# Altium schematic sheet [4]-Wifi.SchDoc
size A3
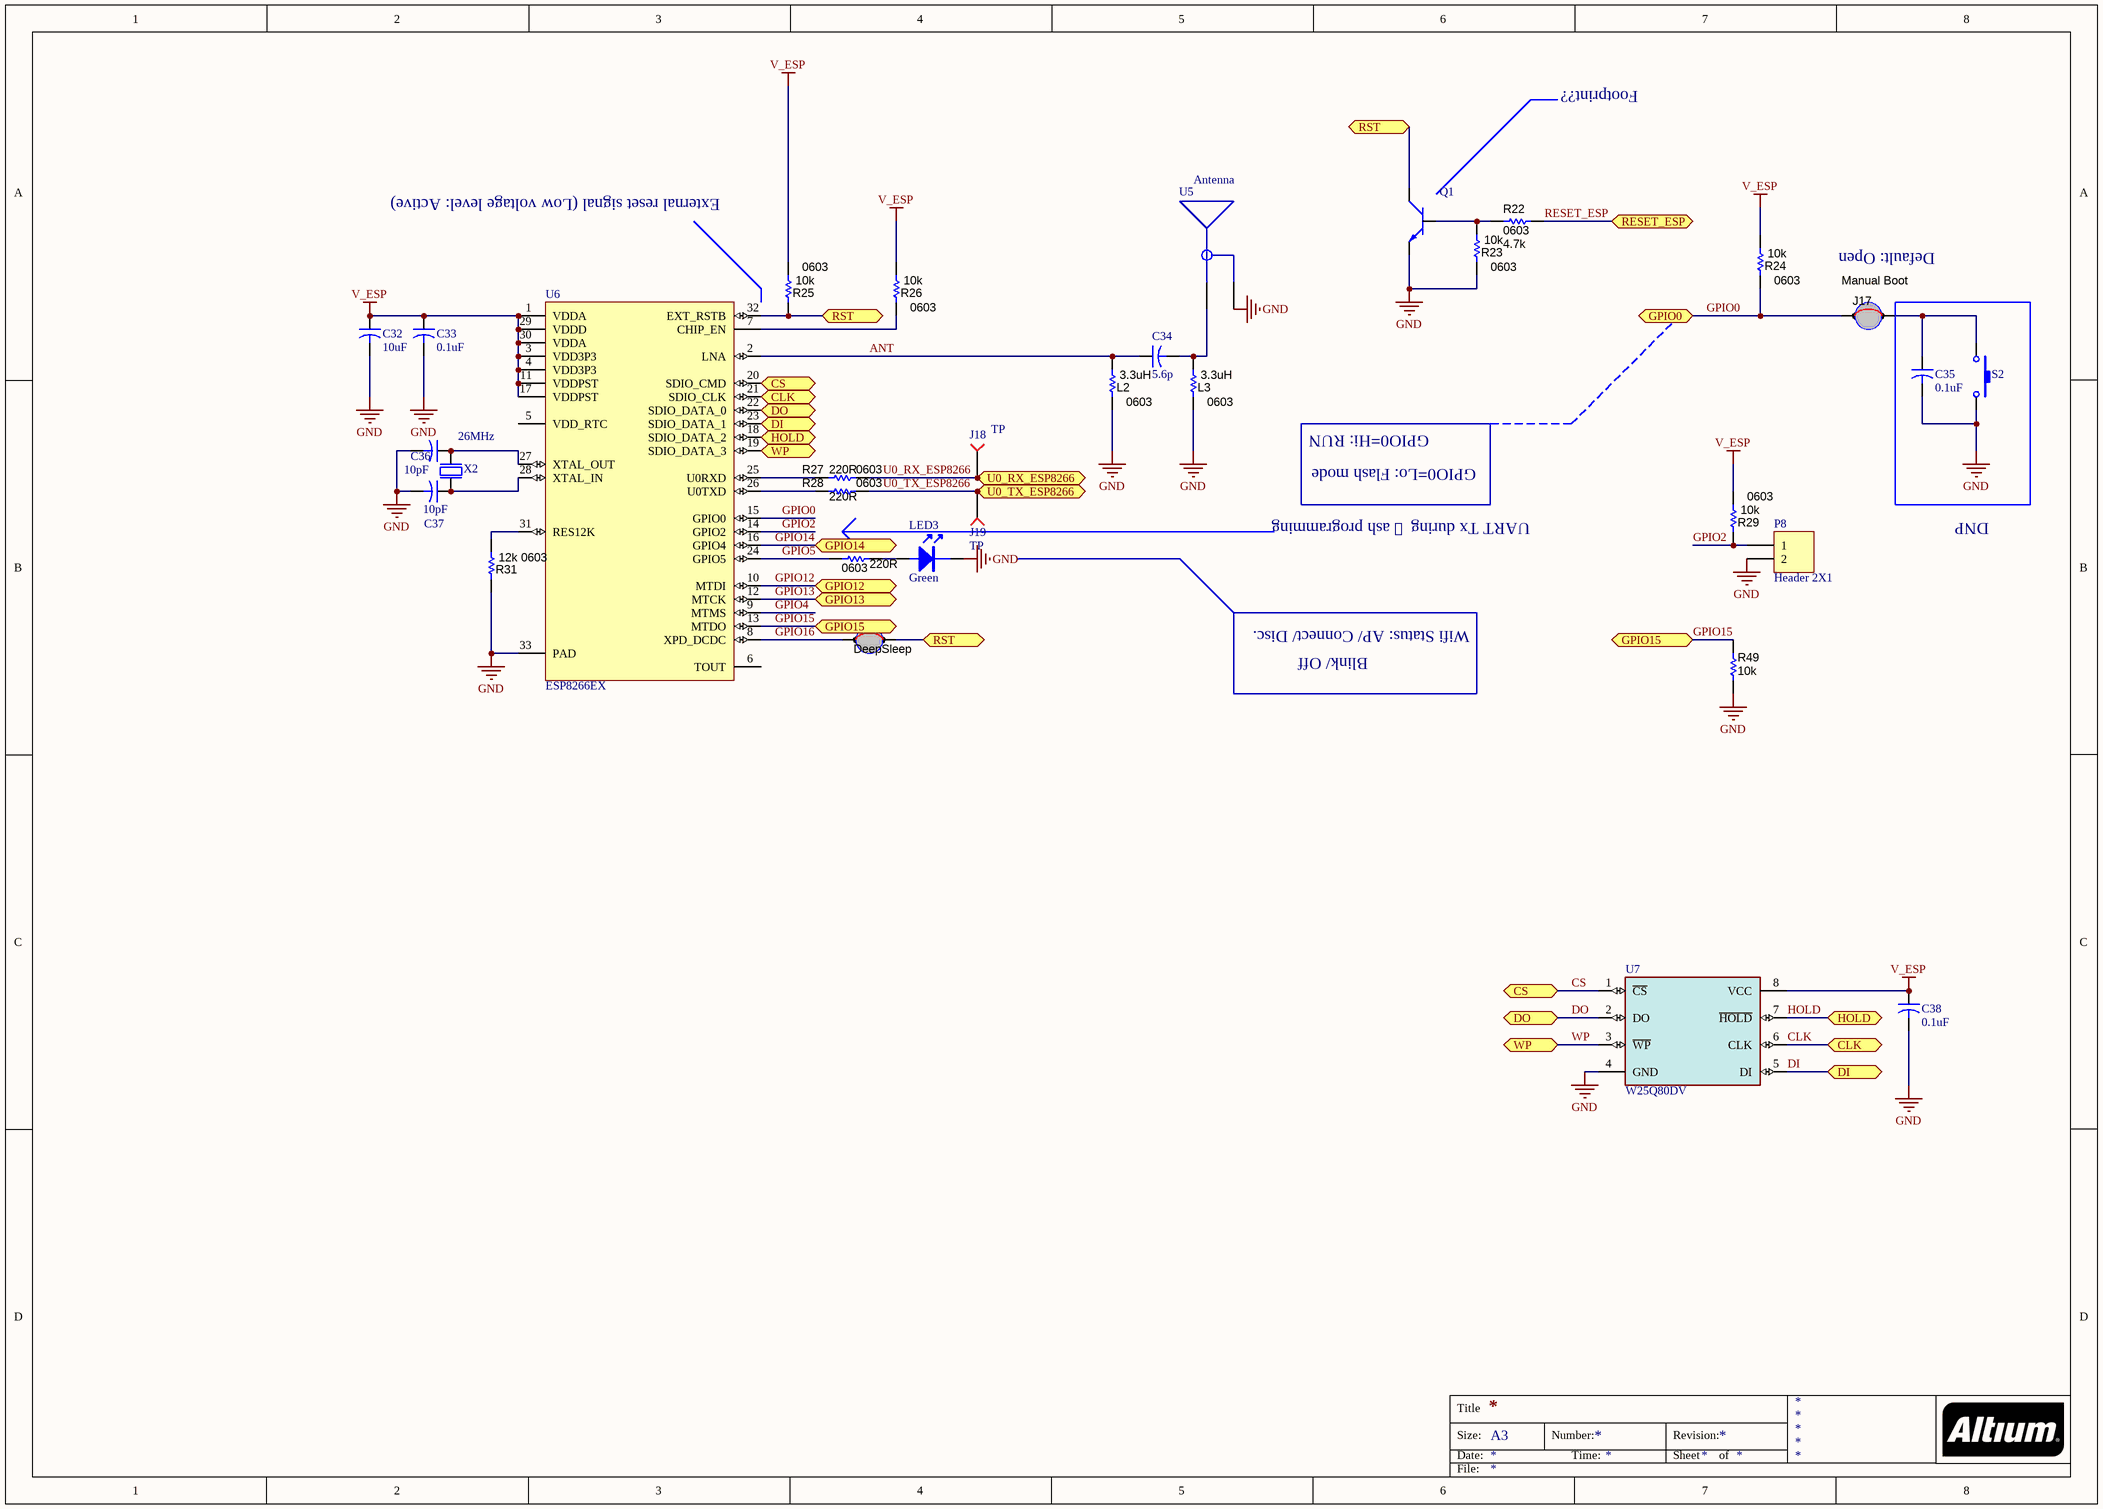
[diagram p0: [4]-Wifi.SchDoc]

## Parts
C32  10uF  [0603]
C33  0.1uF  [0603]
C34  5.6p  [0402]
C35  0.1uF  [0603]
C36  10pF  [0402]
C37  10pF  [0402]
C38  0.1uF  [0603]
J17  Manual Boot  [HDR1X2]
J18  TP  [TP]
J19  TP  [TP]
J20  DeepSleep  [HDR1X2]
L2  value 3.3uH  Value1: 0603  [0402]  (hidden comment: CRCW08051K00JNEA)
L3  value 3.3uH  Value1: 0603  [0402]  (hidden comment: CRCW08051K00JNEA)
LED3  Green  [led0603]
P8  Header 2X1  [hdr1X2]
Q1  MMBT2222A  [SOT23A]  (value not drawn)
R22  value 4.7k  [0603]  (hidden comment: CRCW08051K00JNEA)
R23  value 10k  [0603]  (hidden comment: CRCW08051K00JNEA)
R24  value 10k  [0603]  (hidden comment: CRCW08051K00JNEA)
R25  value 10k  [0603]  (hidden comment: CRCW08051K00JNEA)
R26  value 10k  [0603]  (hidden comment: CRCW08051K00JNEA)
R27  value 220R  [0603]  (hidden comment: CRCW08051K00JNEA)
R28  value 220R  [0603]  (hidden comment: CRCW08051K00JNEA)
R29  value 10k  [0603]  (hidden comment: CRCW08051K00JNEA)
R30  value 220R  [0603]  (hidden comment: CRCW08051K00JNEA)
R31  value 12k 0603  [0603]  (hidden comment: CRCW08051K00JNEA)
R49  value 10k  [0603]  (hidden comment: CRCW06031K00FKEA)
S2  SW-SMD  [SW-SMD]  (value not drawn)
U5  Antenna  [ANT_F]
U6  ESP8266EX  [QFN32_ESP8266]
U7  W25Q80DV  [SOIC8_208mil]
X2  26MHz  [BT-XTAL_3225]

## Ports
CLK (bidir), CS (bidir), DI (bidir), DO (bidir), GPIO0 (bidir), GPIO12 (bidir), GPIO13 (bidir), GPIO14 (bidir), GPIO15 (bidir), HOLD (bidir), RESET_ESP (bidir), RST (bidir), U0_RX_ESP8266 (bidir), U0_TX_ESP8266 (bidir), WP (bidir)

## Nets
GND: C32.2 C33.2 C35.2 C36.2 C37.2 C38.2 L2.1 L3.1 LED3.2 P8.2 Q1.2(E) R23.1 R31.1 R49.2 S2.2 U5.2(GND) U6.33(PAD) U7.4(GND) X2.2(GND) X2.4(GND)
V_ESP: C32.1 C33.1 C38.1 R24.2 R25.2 R26.2 R29.2 U6.1(VDDA) U6.3(VDD3P3) U6.4(VDD3P3) U6.11(VDDPST) U6.17(VDDPST) U6.29(VDDD) U6.30(VDDA) U7.8(VCC)
ANT: C34.1 L2.2 U6.2(LNA)
CLK: U6.21(SDIO_CLK) U7.6(CLK) ; port CLK
CS: U6.20(SDIO_CMD) U7.1(~{CS}) ; port CS
DI: U6.23(SDIO_DATA_1) U7.5(DI) ; port DI
DO: U6.22(SDIO_DATA_0) U7.2(DO) ; port DO
GPIO0: J17.1 R24.1 U6.15(GPIO0) ; port GPIO0
GPIO2: P8.1 R29.1 U6.14(GPIO2)
GPIO4: U6.9(MTMS)
GPIO5: R30.2 U6.24(GPIO5)
GPIO12: U6.10(MTDI) ; port GPIO12
GPIO13: U6.12(MTCK) ; port GPIO13
GPIO14: U6.16(GPIO4) ; port GPIO14
GPIO15: R49.1 U6.13(MTDO) ; port GPIO15
GPIO16: J20.1 U6.8(XPD_DCDC)
HOLD: U6.18(SDIO_DATA_2) U7.7(~{HOLD}) ; port HOLD
RESET_ESP: R22.1 ; port RESET_ESP
RST: J20.2 Q1.3(C) R25.1 U6.32(EXT_RSTB) ; port RST
U0_RX_ESP8266: J18.0 R27.1 ; port U0_RX_ESP8266
U0_TX_ESP8266: J19.0 R28.1 ; port U0_TX_ESP8266
WP: U6.19(SDIO_DATA_3) U7.3(~{WP}) ; port WP
NetC34_2: C34.2 L3.2 U5.1(ANT)
NetC35_1: C35.1 J17.2 S2.1
NetC36_1: C36.1 U6.27(XTAL_OUT) X2.3(out)
NetC37_1: C37.1 U6.28(XTAL_IN) X2.1(inp)
NetLED3_1: LED3.1 R30.1
NetQ1_1: Q1.1(B) R22.2 R23.2
NetR26_1: R26.1 U6.7(CHIP_EN)
NetR27_2: R27.2 U6.25(U0RXD)
NetR28_2: R28.2 U6.26(U0TXD)
NetR31_2: R31.2 U6.31(RES12K)

Not connected (* = marked no-connect by the designer): U6 5(VDD_RTC) 6(TOUT)

## Notes on the sheet
- Footprint??
- External reset signal (Low voltage level: Active)
- Default: Open
- GPIO0=Hi: RUN
- GPIO0=Lo: Flash mode
- UART Tx during ﬂash programming
- DNP
- Blink/ Off
- Wifi Status: AP/ Connect/ Disc.
- Title
- Size:
- Date:
- A3
- Number:
- Time:
- Revision:
- Sheet
- of
- File:

## Library data of the parts
C32-C38 = Cap 0805: Ceramic; Published: 8-Jun-2000; LatestRevisionDate: 17-Jul-2002; LatestRevisionNote: Re-released for DXP Platform.; PackageReference: POLAR0.8; Publisher: Altium Limited
J17 J20 = 923345-02-C: Jumper Wire, 200mil spacing, Red, pkg of 200; Manufacturer: 3M; Alternate Manufacturer: Any; Alternate PartNumber: Equivalent; SymbolCreator: a0412235; U/M: EA; SymbolVersion: 2010-08-18; PartNumber: 923345-02-C; CompType: Jumper Wire; RoHS: Y; PackageReference: 200 mil Jumper Wire; MountType: TH; ComponentLink1Description: Datasheet Link; ComponentLink1URL: http://multimedia.3m.com/mws/mediawebserver?66666UuZjcFSLXTtNX&c5x&6EVuQEcuZgVs6EVs6E666666--; Publisher: Texas Instruments; LatestRevisionDate: 2012-11-04; LatestRevisionNote: Added parts, moved some to Hardware.IntLib; Supplier 1: Digi-Key; Supplier Part Number 1: 923345-02-ND; Supplier 2: Mouser; Supplier Part Number 2: 517-923345-02; Supplier 3: Newark; Supplier Part Number 3: 19M8560
J18 J19 = TP: Test point (true); .Sch checked: OK; .PCB  checked: OK
L2 L3 R22-R31 = R0805_025W: RES 5%, 0.125W, 0805; Manufacturer: Vishay-Dale; Alternate Manufacturer: Any; Alternate PartNumber: Equivalent; CompType: Resistor; Res_ohm: 1000; Value_Code: 1k00; Tolerance_%: 5; Power_W: 0.125; VDC_V: 150; TempCo: 200 ppm/C; EIA_Code: E24; U/M: EA; SymbolVersion: 2009-05-29; PartNumber: CRCW08051K00JNEA; PackageReference: 0805; RoHS: Y; Value2: 0.125W; MountType: SMT; Technology: Thick Film; Published: 2008-06-26; Publisher: Texas Instruments; LatestRevisionDate: 2012-10-04; LatestRevisionNote: Changed publisher; ComponentLink1Description: Datasheet link; ComponentLink1URL: http://www.vishay.com/docs/20035/dcrcwe3.pdf; Supplier 1: Digi-Key; Supplier Part Number 1: 541-1.0KACT-ND; Supplier 2: Farnell; Supplier Part Number 2: 1562615; Supplier 3: Newark; Supplier Part Number 3: 52K9725
  R22-R30: Value1: 0603
  R31: Value1: 5%
LED3 = LEDSMD: LED SMD; LED: SMD 0603
P8 = Header 2X1: Header, 2-Pin; LatestRevisionDate: 17-Jul-2002; LatestRevisionNote: Re-released for DXP Platform.; Publisher: Altium Limited
Q1 = MMBT2222A: NPN switching transistor  40V 600mA SOT23; Manufacturer: Fairchild; Ic: 1000mA; Name: MMBT2222; Vce: 40V; Datasheet: http://www.farnell.com/datasheets/1842966.pdf; Footprint: SOT23
R49 = R0603: RES, 1.00k ohm, 1%, 0.1W, 0603; Manufacturer: Vishay-Dale; Alternate Manufacturer: Any; Alternate PartNumber: Equivalent; CompType: Resistor; Res_ohm: 1000; Value_Code: 1k00; Tolerance_%: 1; Power_W: 0.1; VDC_V: 75; TempCo: 100 ppm/C; EIA_Code: E96; U/M: EA; SymbolVersion: 2009-05-29; PartNumber: CRCW06031K00FKEA; PackageReference: 0603; RoHS: Y; Value1: 1%; Value2: 0.1W; MountType: SMT; Technology: Thick Film; Published: 2008-06-26; Publisher: Texas Instruments; LatestRevisionDate: 2012-10-04; LatestRevisionNote: Changed publisher; ComponentLink1Description: Datasheet link; ComponentLink1URL: http://www.vishay.com/docs/20035/dcrcwe3.pdf; Supplier 1: Digi-Key; Supplier Part Number 1: 541-1.00KHCT-ND; Supplier 2: Farnell; Supplier Part Number 2: 1151593; Supplier 3: Newark; Supplier Part Number 3: 52K8015
S2 = SW-SMD: Switch; Published: 24-Mar-1999; LatestRevisionDate: 17-Jul-2002; LatestRevisionNote: Re-released for DXP Platform.; PackageReference: SPST-2; Publisher: Altium Limited
U6 = ESP8266EX: ESP8266EX Espressif Systems; PIN_COUNT: 32; Datasheet URL: https://www.adafruit.com/images/product-files/2471/0A-ESP8266__Datasheet__EN_v4.3.pdf; RefDes: RefDes; Type: DEV; Value: Value
U7 = W25Q80DV: IC FLASH 8MBIT 104MHZ 8SOIC; Manufacturer_Part_Number: W25Q80DVSSIG; Manufacturer: Winbond; PIN_COUNT: 8; Price (1ku-$): 0.27255; Digi-Key Part Number: W25Q80DVSSIG-ND; Datasheet URL: http://www.winbond.com/resource-files/w25q80dv_revf_02112015.pdf; RefDes: RefDes; Type: DEV; Value: Value
X2 = XTAL_SMD2520: XTAL SMD 2520, 16MHz, 8pF, ±40ppm; Part Number: XTAL_SMD2520_16MHz_8pF_NDK; Manufacturer: NDK; Manufacturer Part Number: NX2520SA/16MHz/EXS00A-CS06713; Note: XTAL SMD 16.000MHz; Artikkelnr Noca: 22019192; Artikkelnr Simpro: N.A.; Datasheet: http://www.ndk.com/images/products/catalog/c_NX2520SA-STD-CSW-5_e.pdf; LatestRevisionDate: 2014-11-27; Pin Count: 4; Publisher: Nordic Semiconductor; Published: 2012-06-15; Value: 26MHz; Supplier: Digi-Key; Supplier part number: 644-1169-1-ND; 2nd source Supplier: *; 2nd source part number: *; Footprint Doc: XTAL_2520